# EasyEDA Pro project testboard.epro

# Schematic PnP verify board
Board Name: Board1; Create Date: 2025-08-08; Page Name: P1; Project Name: New Project_2025-08-08_01-12-41; Schematic Name: PnP verify board; Update Date: 2025-08-08; Company: 嘉立创EDA; Page Size: A4; Version: V1.0
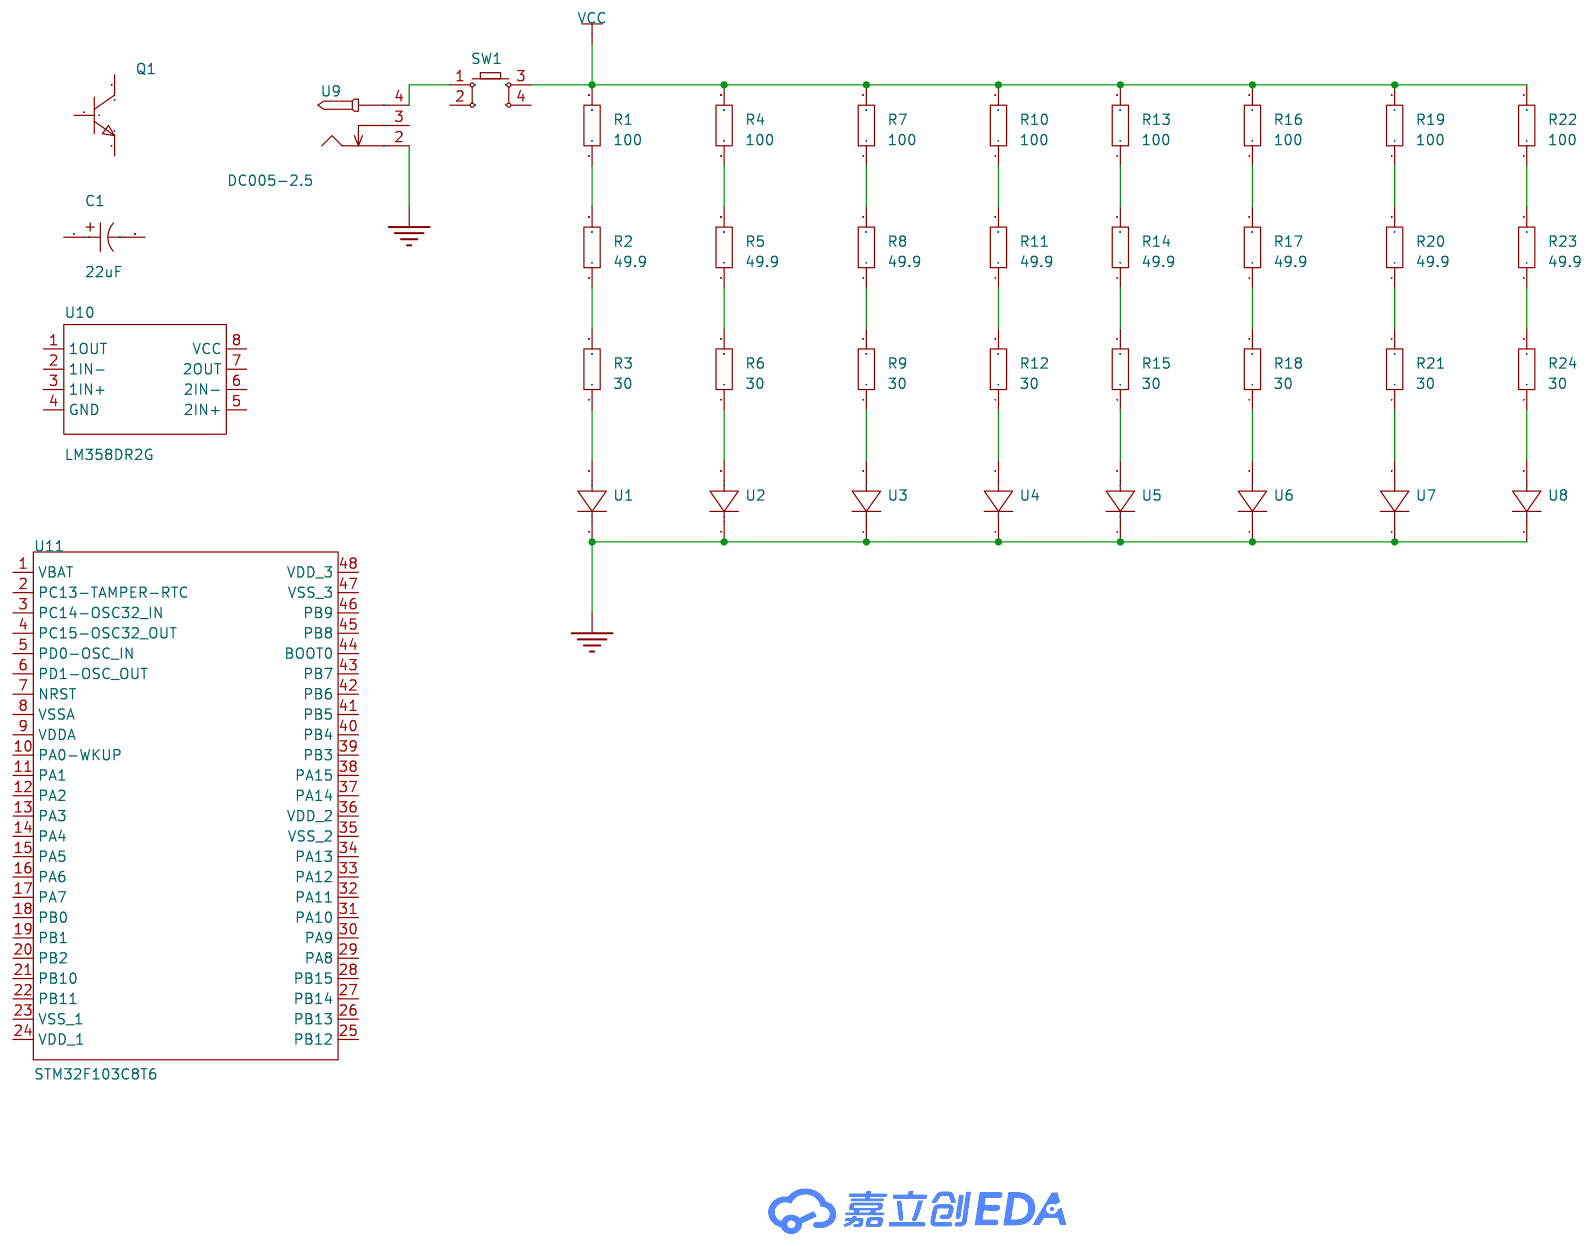
[diagram p0: schematic sheet]

## Parts
C1  22uF  [CAP-SMD_BD5.0-L5.3-W5.3-FD]
Q1  -  [S8050_SOT-23]
R1  100  [R0402]
R2  49.9  [R0603]
R3  30  [R0805_1]
R4  100  [R0402]
R5  49.9  [R0603]
R6  30  [R0805_1]
R7  100  [R0402]
R8  49.9  [R0603]
R9  30  [R0805_1]
R10  100  [R0402]
R11  49.9  [R0603]
R12  30  [R0805_1]
R13  100  [R0402]
R14  49.9  [R0603]
R15  30  [R0805_1]
R16  100  [R0402]
R17  49.9  [R0603]
R18  30  [R0805_1]
R19  100  [R0402]
R20  49.9  [R0603]
R21  30  [R0805_1]
R22  100  [R0402]
R23  49.9  [R0603]
R24  30  [R0805_1]
SW1  -  [SW-SMD_4P-L6.0-W6.0-P4.50-LS9.0-2]
U1  LTST-C190YKT  [LED0603-RD]
U2  LTST-C190YKT  [LED0603-RD]
U3  LTST-C190YKT  [LED0603-RD]
U4  LTST-C190YKT  [LED0603-RD]
U5  LTST-C190YKT  [LED0603-RD]
U6  LTST-C190YKT  [LED0603-RD]
U7  LTST-C190YKT  [LED0603-RD]
U8  LTST-C190YKT  [LED0603-RD]
U9  DC005-2.5  [DC-IN-TH_DC005-2.5MM]
U10  LM358DR2G  [SOIC-8_L5.0-W4.0-P1.27-LS6.0-BL]
U11  STM32F103C8T6  [LQFP-48_L7.0-W7.0-P0.50-LS9.0-BL]

## Library data of the parts
C1 = RYHV25V22UF5*8: 容值:22uF;额定电压:25V;; LCSC Part Name: 22uF 25V; Supplier Part: C48970687; Manufacturer: HONOR(荣誉); Supplier Footprint: SMD,D5xL5.8mm; JLCPCB Part Class: 扩展库; Datasheet: https://atta.szlcsc.com/upload/public/pdf/source/20250519/1188E75EFE4D533DF64701043549A63C.pdf; Supplier: LCSC; Voltage Rating: 25V
Q1 = S8050_SOT_NPN: Supplier Footprint: SOT-23
R1-R24 = Res_0603: Supplier Footprint: 0603
SW1 = Key_SMD_6x6x6.5: Supplier Footprint: SMD
U1-U8 = LTST-C190YKT: 发光颜色:黄色;正向电压(VF):2.1V;功率:60mW;正向电流:20mA;主波长:588nm;二极管配置:-;透镜颜色:无色透明透镜;色温:-;发光强度:6mcd;发光角度:130°;载带方式:-;工作温度:-55℃~+85℃;; LCSC Part Name: 黄灯; Supplier Part: C125097; Manufacturer: LITEON(光宝); Supplier Footprint: 0603; JLCPCB Part Class: Extended Part; Datasheet: https://atta.szlcsc.com/upload/public/pdf/source/20180326/C125097_8A610ECE31461EDC7D081EA09A856E73.pdf; Supplier: LCSC; Emitted Color: 黄色; Forward Voltage (VF): 2.1V; Power Dissipation: 60mW; Forward Current: 20mA; Dominant Wavelength: 588nm; Peak Wavelength: 585nm; Lens Color: 无色透明透镜; Luminous Intensity: 6mcd; Viewing Angle: 130°; Operating Temperature: -55℃~+85℃
U9 = DC005-2.5: 连接器类型:DC电源插座;安装方式:弯插;触点内径:2.5mm;触点外径:6.3mm;额定电流:500mA;额定电压:30V;工作温度范围:-25℃~+70℃;; LCSC Part Name: DC电源插座 内径:2.5mm 外径:6.3mm; Supplier Part: C7507454; Manufacturer: SHOU HAN(首韩); Supplier Footprint: 插件; JLCPCB Part Class: 扩展库; Datasheet: https://atta.szlcsc.com/upload/public/pdf/source/20231013/7634FFE9E6B635EE77C0C008CDC877DB.pdf; Supplier: LCSC; Connector Type: DC电源插座; Mounting Style: 弯插; Inside Contact Diameter: 2.5mm; Outside Contact Diameter: 6.3mm; Current Rating (Max): 500mA; Voltage Rating (Max): 30V; Operating Temperature Range: -25℃~+70℃
U10 = LM358DR2G: 放大器数:双路;轨到轨:-;增益带宽积(GBP):-;输入失调电压(Vos):7mV;压摆率(SR):-;输入偏置电流(Ib):150nA;; Supplier Part: C7950; Manufacturer: onsemi(安森美); Supplier Footprint: SOIC-8; JLCPCB Part Class: 基础库; Datasheet: https://atta.szlcsc.com/upload/public/pdf/source/20150124/1457707258826.pdf; Supplier: LCSC; Number of Channels: 双路; Maximum Power Supply Range (Vdd-Vss): 32V; Vos - Input Offset Voltage: 7mV; Input Offset Voltage Drift(Vos TC): 10uV/℃; Ib - Input Bias Current: 150nA; Common Mode Rejection Ratio(CMRR): 70dB; Operating Temperature: 0℃~+70℃; Single supply: 3V~32V; Dual Supply: -16V~16V
U11 = STM32F103C8T6: CPU内核:ARM-M3;CPU最大主频:72MHz;应用领域:-;; LCSC Part Name: 主流增强型ARM Cortex-M3 MCU，具有64 KB Flash、72 MHz CPU、电机控制、USB和CAN; Supplier Part: C8734; Manufacturer: ST(意法半导体); Supplier Footprint: LQFP-48(7x7); JLCPCB Part Class: 扩展库; Datasheet: https://atta.szlcsc.com/upload/public/pdf/source/20220812/8363ACEC51AD55ECEB84799464F7CB85.pdf; Supplier: LCSC; CPU Core: ARM-M3; CPU Maximum Speed: 72MHz; Program Storage Size: 64KB; Program Memory Type: FLASH; Number of I/O: 37; ADC (Bit): 12bit; Voltage - Supply: 2V~3.6V

## Nets
GND: U1.1(K) U2.1(K) U3.1(K) U4.1(K) U5.1(K) U6.1(K) U7.1(K) U8.1(K) U9.2
VCC: R1.2 R4.2 R7.2 R10.2 R13.2 R16.2 R19.2 R22.2 SW1.3
$1N1180: R1.1 R2.2
$1N1187: R2.1 R3.2
$1N1191: R4.1 R5.2
$1N1195: R5.1 R6.2
$1N1200: R8.1 R9.2
$1N1205: R7.1 R8.2
$1N1210: R10.1 R11.2
$1N1215: R11.1 R12.2
$1N1590: R12.1 U4.2(A)
$1N1597: R9.1 U3.2(A)
$1N1602: R6.1 U2.2(A)
$1N1607: R3.1 U1.2(A)
$1N1782: R13.1 R14.2
$1N1784: R14.1 R15.2
$1N1786: R15.1 U5.2(A)
$1N1900: R16.1 R17.2
$1N1902: R17.1 R18.2
$1N1904: R18.1 U6.2(A)
$1N2018: R19.1 R20.2
$1N2020: R20.1 R21.2
$1N2022: R21.1 U7.2(A)
$1N2136: R22.1 R23.2
$1N2138: R23.1 R24.2
$1N2140: R24.1 U8.2(A)
Net-(SW1-1): SW1.1 U9.4

Not connected (* = marked no-connect by the designer): C1 1 2; Q1 1 2 3; SW1 2 4; U9 3; U10 1(1OUT) 2(1IN-) 3(1IN+) 4(GND) 5(2IN+) 6(2IN-) 7(2OUT) 8(VCC); U11 1(VBAT) 2(PC13-TAMPER-RTC) 3(PC14-OSC32_IN) 4(PC15-OSC32_OUT) 5(PD0-OSC_IN) 6(PD1-OSC_OUT) 7(NRST) 8(VSSA) 9(VDDA) 10(PA0-WKUP) 11(PA1) 12(PA2) 13(PA3) 14(PA4) 15(PA5) 16(PA6) 17(PA7) 18(PB0) 19(PB1) 20(PB2) 21(PB10) 22(PB11) 23(VSS_1) 24(VDD_1) 25(PB12) 26(PB13) 27(PB14) 28(PB15) 29(PA8) 30(PA9) 31(PA10) 32(PA11) 33(PA12) 34(PA13) 35(VSS_2) 36(VDD_2) 37(PA14) 38(PA15) 39(PB3) 40(PB4) 41(PB5) 42(PB6) 43(PB7) 44(BOOT0) 45(PB8) 46(PB9) 47(VSS_3) 48(VDD_3)

# Board PCB1
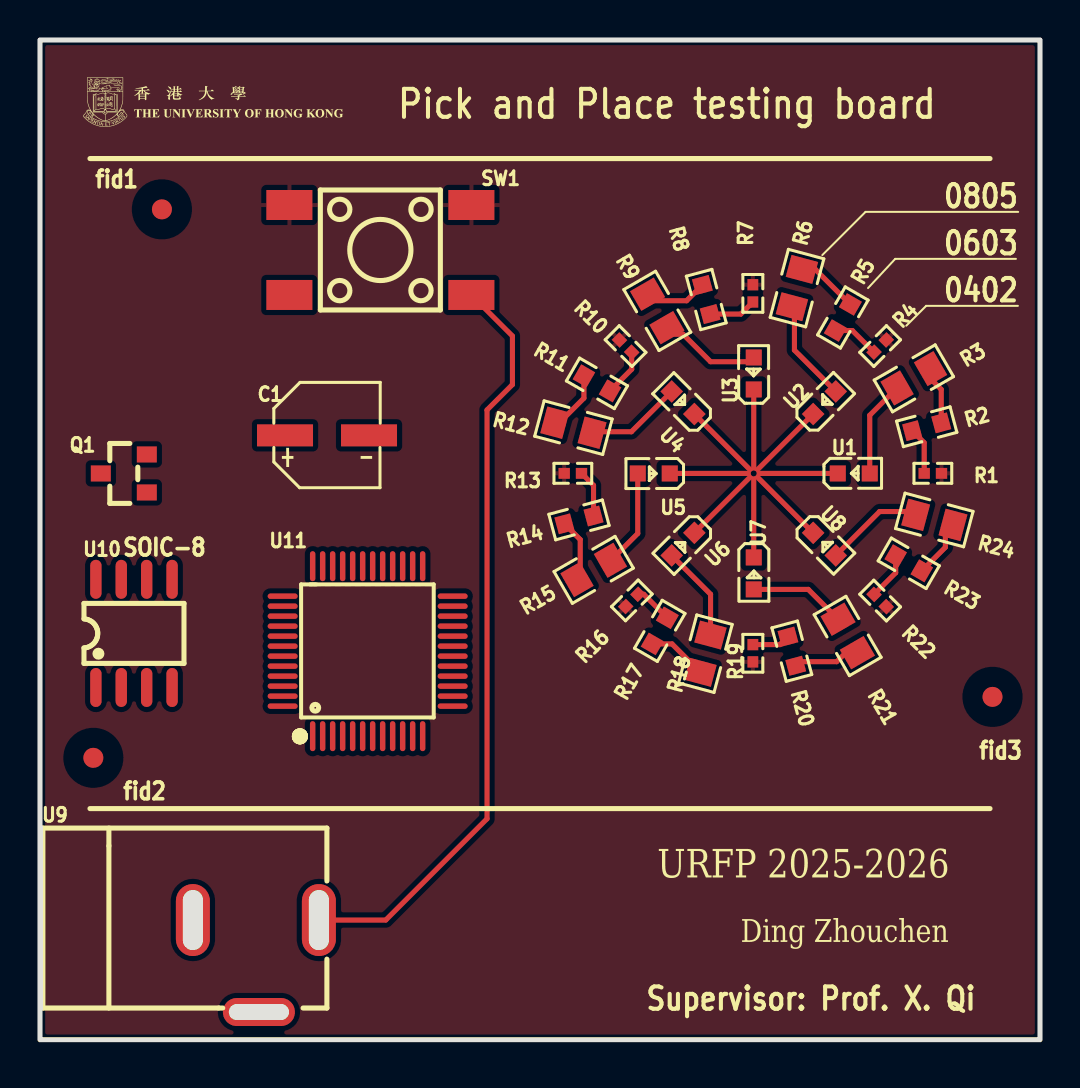
[diagram p1: board, top side]
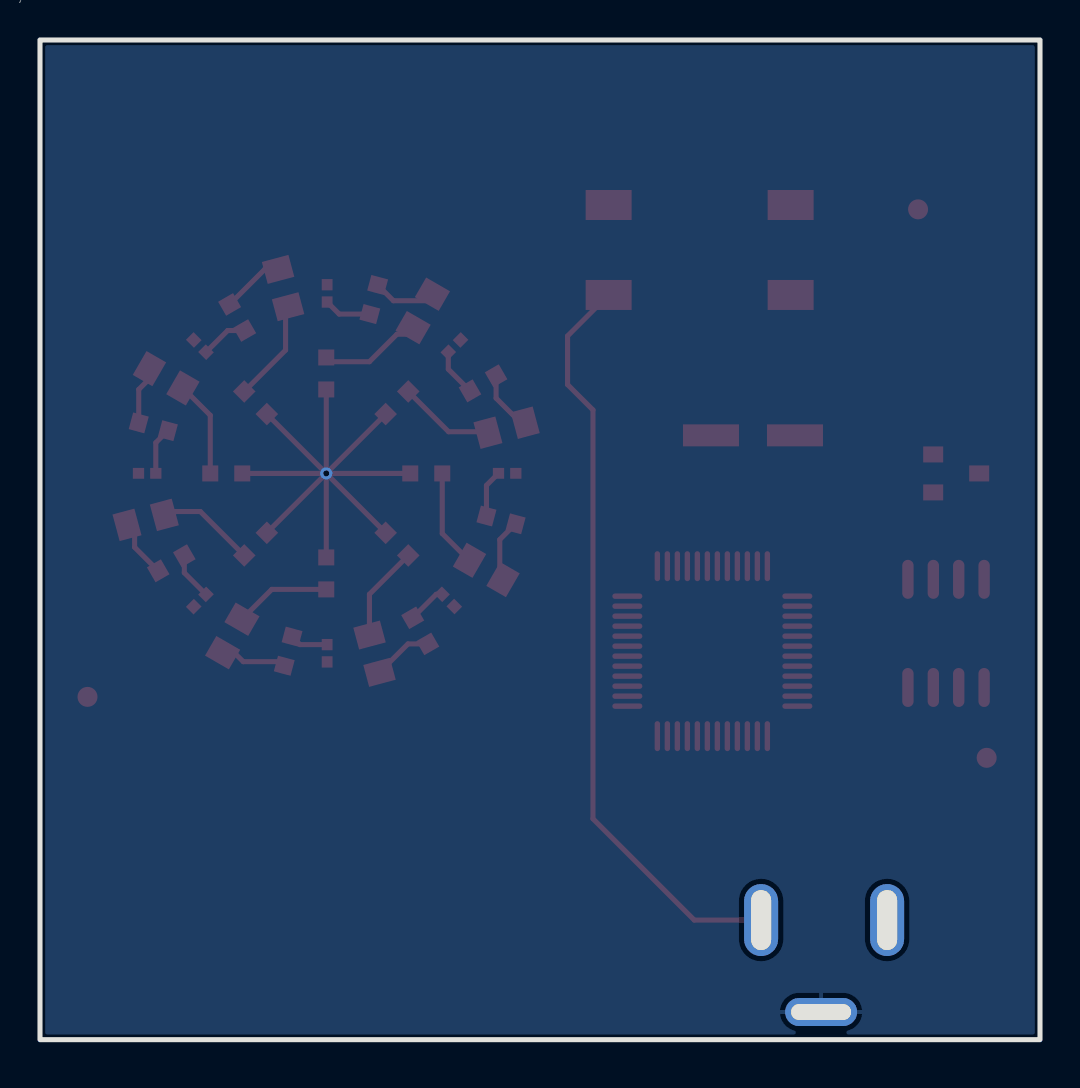
[diagram p2: board, bottom side, seen from below]

Outline 50 x 50 mm; copper layers: Top Layer, Bottom Layer. Coordinates in mm from the lower left corner of the outline.
Outline path: rectangle 0,50 50,0
Stack: Top Layer 0.035mm / Dielectric1 1.51mm FR4 er 4.5 / Bottom Layer 0.035mm

## Design rules (mm)
template: JLCPCB Capability(Two Layers Board)
spacing copperThickness1oz (default): track to track 0.102, other pairs 0.152 to 0.3
spacing copperThickness2oz: track to track 0.203, other pairs 0.152 to 0.3
track width copperThickness1oz (default): min 0.127, default 0.254, max 2.54
track width copperThickness2oz: min 0.203, default 0.254, max 2.54
differential pair differentialPair (default): width min 0.127, default 0.254, max 2.54; gap min 0.152, default 0.152
via viaSize (default): diameter min 0.5, default 0.61, max 10; hole min 0.3, default 0.305, max 6.3

## Placement (name value [footprint] x y rotation side)
C1  22uF  [CAP-SMD_BD5.0-L5.3-W5.3-FD]  14.35 30.23 0 top
NOREF  -  [Pad_e105]  47.62 17.14 0 top
NOREF#2  -  [Pad_e104]  2.67 14.1 0 top
NOREF#3  -  [Pad_e102]  6.1 41.53 0 top
Q1  -  [S8050_SOT-23]  4.19 28.19 0 top
R1  100  [R0402]  44.64 28.33 0 top
R2  49.9  [R0603]  44.34 30.66 195 top
R3  30  [R0805_1]  43.69 33.08 30 top
R4  100  [R0402]  42.01 34.69 45 top
R5  49.9  [R0603]  40.14 36.12 240 top
R6  30  [R0805_1]  37.85 37.59 75 top
R7  100  [R0402]  35.64 37.33 90 top
R8  49.9  [R0603]  33.31 37.02 285 top
R9  30  [R0805_1]  30.86 36.45 120 top
R10  100  [R0402]  29.28 34.69 135 top
R11  49.9  [R0603]  27.85 32.83 330 top
R12  30  [R0805_1]  26.67 30.61 165 top
R13  100  [R0402]  26.64 28.33 180 top
R14  49.9  [R0603]  26.95 26 15 top
R15  30  [R0805_1]  27.69 23.5 210 top
R16  100  [R0402]  29.59 21.97 225 top
R17  49.9  [R0603]  30.99 20.45 60 top
R18  30  [R0805_1]  33.27 19.3 255 top
R19  100  [R0402]  35.64 19.33 270 top
R20  49.9  [R0603]  37.59 19.43 105 top
R21  30  [R0805_1]  40.39 20.19 300 top
R22  100  [R0402]  42.01 21.96 315 top
R23  49.9  [R0603]  43.44 23.83 150 top
R24  30  [R0805_1]  44.72 26 345 top
SW1  -  [SW-SMD_4P-L6.0-W6.0-P4.50-LS9.0-2]  17.02 39.5 180 top
U1  LTST-C190YKT  [LED0603-RD]  40.69 28.32 0 top
U2  LTST-C190YKT  [LED0603-RD]  39.22 31.86 45 top
U3  LTST-C190YKT  [LED0603-RD]  35.69 33.32 90 top
U4  LTST-C190YKT  [LED0603-RD]  32.15 31.86 135 top
U5  LTST-C190YKT  [LED0603-RD]  30.69 28.32 180 top
U6  LTST-C190YKT  [LED0603-RD]  32.15 24.79 225 top
U7  LTST-C190YKT  [LED0603-RD]  35.69 23.32 270 top
U8  LTST-C190YKT  [LED0603-RD]  39.22 24.79 315 top
U9  DC005-2.5  [DC-IN-TH_DC005-2.5MM]  10.79 3.68 0 top
U10  LM358DR2G  [SOIC-8_L5.0-W4.0-P1.27-LS6.0-BL]  4.7 20.32 0 top
U11  STM32F103C8T6  [LQFP-48_L7.0-W7.0-P0.50-LS9.0-BL]  16.38 19.43 0 top

## Footprints (pads in the part's own frame, mm; a bottom-side part is the same pattern mirrored in y, then rotated)
CAP-SMD_BD5.0-L5.3-W5.3-FD
  rect 2.8x1.1 smd: 1(-2.1,0) 2(2.1,0)
DC-IN-TH_DC005-2.5MM
  oval 3.6x1.4 hole 3x0.8: 2(0.15,-2.3)
  oval 1.7x3.6 hole 1x3: 3(-3.15,2.3) 4(3.15,2.3)
LED0603-RD
  rect 0.8x0.8 smd: 1(-0.799,0) 2(0.799,0)
LQFP-48_L7.0-W7.0-P0.50-LS9.0-BL
  oval 0.27x1.5 smd: 1(-2.75,-4.25) 2(-2.25,-4.25) 3(-1.75,-4.25) 4(-1.25,-4.25) 5(-0.75,-4.25) 6(-0.25,-4.25) 7(0.25,-4.25) 8(0.75,-4.25) 9(1.25,-4.25) 10(1.75,-4.25) 11(2.25,-4.25) 12(2.75,-4.25) 25(2.75,4.25) 26(2.25,4.25) 27(1.75,4.25) 28(1.25,4.25) 29(0.75,4.25) 30(0.25,4.25) 31(-0.25,4.25) 32(-0.75,4.25) 33(-1.25,4.25) 34(-1.75,4.25) 35(-2.25,4.25) 36(-2.75,4.25)
  oval 1.5x0.27 smd: 13(4.25,-2.75) 14(4.25,-2.25) 15(4.25,-1.75) 16(4.25,-1.25) 17(4.25,-0.75) 18(4.25,-0.25) 19(4.25,0.25) 20(4.25,0.75) 21(4.25,1.25) 22(4.25,1.75) 23(4.25,2.25) 24(4.25,2.75) 37(-4.25,2.75) 38(-4.25,2.25) 39(-4.25,1.75) 40(-4.25,1.25) 41(-4.25,0.75) 42(-4.25,0.25) 43(-4.25,-0.25) 44(-4.25,-0.75) 45(-4.25,-1.25) 46(-4.25,-1.75) 47(-4.25,-2.25) 48(-4.25,-2.75)
Pad_e102
  round 1 smd: 1(0,0)
Pad_e104
  round 1 smd: FID2(0,0)
Pad_e105
  round 1 smd: FID3(0,0)
R0402
  rect 0.566x0.54 smd: 1(-0.433,0) 2(0.433,0)
R0603
  rect 0.806x0.864 smd: 1(-0.753,0) 2(0.753,0)
R0805_1
  rect 1.133x1.377 smd: 1(-0.966,0) 2(0.966,0)
S8050_SOT-23
  rect 1x0.8 smd: 1(1.15,-0.823) 2(1.15,1.077) 3(-1.15,0.127)
SOIC-8_L5.0-W4.0-P1.27-LS6.0-BL
  oval 0.569x1.95 smd: 1(-1.905,-2.705) 2(-0.635,-2.705) 3(0.635,-2.705) 4(1.905,-2.705) 5(1.905,2.705) 6(0.635,2.705) 7(-0.635,2.705) 8(-1.905,2.705)
SW-SMD_4P-L6.0-W6.0-P4.50-LS9.0-2
  rect 2.3x1.5 smd: 1(-4.55,2.25) 2(4.55,2.25) 3(-4.55,-2.25) 4(4.55,-2.25)

## Nets
As in the schematic, except:
VCC: R1.2 R4.2 R7.2 R10.2 R13.2 R16.2 R19.2 R22.2 SW1.3 SW1.4
$1N3257: SW1.1 SW1.2 U9.4

Pads without a net: C1 1 2; NOREF FID3; NOREF#2 FID2; NOREF#3 1; Q1 1 2 3; U9 3; U10 1 2 3 4 5 6 7 8; U11 1 2 3 4 5 6 7 8 9 10 11 12 13 14 15 16 17 18 19 20 21 22 23 24 25 26 27 28 29 30 31 32 33 34 35 36 37 38 39 40 41 42 43 44 45 46 47 48

## Via types
v1: diameter 0.61, hole 0.305, Top Layer to Bottom Layer, 1 via

## Routing (per net, layer and track width the routed paths; a pad name or vN(x,y) marks a point on that pad's centre or on a via; arc(x,y) is an arc through that point)
GND: length 33.6
  Top Layer w0.254: v1(35.69,28.32) 32.72,25.35 ; v1(35.69,28.32) U7.1 ; v1(35.69,28.32) U3.1 ; v1(35.69,28.32) U5.1 ; v1(35.69,28.32) 38.66,25.35 ; v1(35.69,28.32) U4.1 ; v1(35.69,28.32) U1.1 ; v1(35.69,28.32) U2.1
$1N1180: length 2.4
  Top Layer w0.254: R1.1 44.21,29.86 R2.2
$1N1187: length 2.8
  Top Layer w0.254: R2.1 45.06,32.52 44.27,33.31
$1N1191: length 2.4
  Top Layer w0.254: R4.1 40.62,35.47 R5.2
$1N1195: length 3.1
  Top Layer w0.254: 40.52,36.77 38.77,38.53 R6.2
$1N1200: length 2.8
  Top Layer w0.254: R8.1 32.33,36.96 30.66,36.96
$1N1205: length 2.4
  Top Layer w0.254: R8.2 35.04,36.29 R7.1
$1N1210: length 2.4
  Top Layer w0.254: R11.2 29.58,33.53 R10.1
$1N1215: length 2.8
  Top Layer w0.254: R11.1 27.2,32.09 26.02,30.91
$1N1590: length 4.5
  Top Layer w0.254: 27.88,30.41 29.57,30.41 U4.2
$1N1597: length 4.7
  Top Layer w0.254: 31.63,35.28 32.15,35.28 33.53,33.91 35.48,33.91 U3.2
$1N1602: length 4.5
  Top Layer w0.254: U2.2 37.72,34.49 37.72,36.09
$1N1607: length 4.5
  Top Layer w0.254: U1.2 41.49,31.23 42.6,32.34
$1N1782: length 2.4
  Top Layer w0.254: R13.1 27.68,27.72 R14.2
$1N1784: length 2.8
  Top Layer w0.254: 27.01,23.34 27.01,25.01 R14.1
$1N1786: length 4.6
  Top Layer w0.254: 28.69,24.31 28.88,24.31 29.89,25.32 U5.2
$1N1900: length 2
  Top Layer w0.254: 29.9,22.28 30.19,22.28 R17.2
$1N1902: length 3
  Top Layer w0.254: R18.2 31.6,19.79 R17.1
$1N1904: length 4.5
  Top Layer w0.254: 33.56,20.57 33.53,20.6 33.53,22.28 U6.2
$1N2018: length 1.9
  Top Layer w0.254: R19.1 37,19.76 R20.2
$1N2020: length 2.8
  Top Layer w0.254: 40.63,19.7 39.84,18.91 38.17,18.91
$1N2022: length 4.8
  Top Layer w0.254: R21.1 38.41,22.52 U7.2
$1N2136: length 2.4
  Top Layer w0.254: R22.1 42.78,23.35 R23.2
$1N2138: length 2.8
  Top Layer w0.254: 45.27,25.75 45.27,24.63 44.09,23.45
$1N2140: length 4.6
  Top Layer w0.254: U8.2 41.98,26.42 43.23,26.42 43.4,26.25
$1N3257: length 38.1
  Top Layer w0.254: U9.4 17.29,5.98 22.35,11.05 22.35,31.5 23.62,32.77 23.62,35.19 SW1.1

## Copper pours and planes (outline as drawn; the poured copper is in the pictures)
GND on Bottom Layer: -2.67,52.2 52.96,52.2 52.96,-2.29 -2.67,-2.29
VCC on Top Layer: -2.29,52.58 52.07,52.58 52.07,-2.03 -2.29,-2.03

## Text on the board
Top Silkscreen Layer: fid1 | SOIC-8 | fid2 | fid3 | 0805 | 0603 | 0402 | Pick and Place testing board | ​​Supervisor: Prof. X. Qi​​ | Ding Zhouchen | URFP 2025-2026
